# EAGLE design schematic (EAGLE 9.6.2)
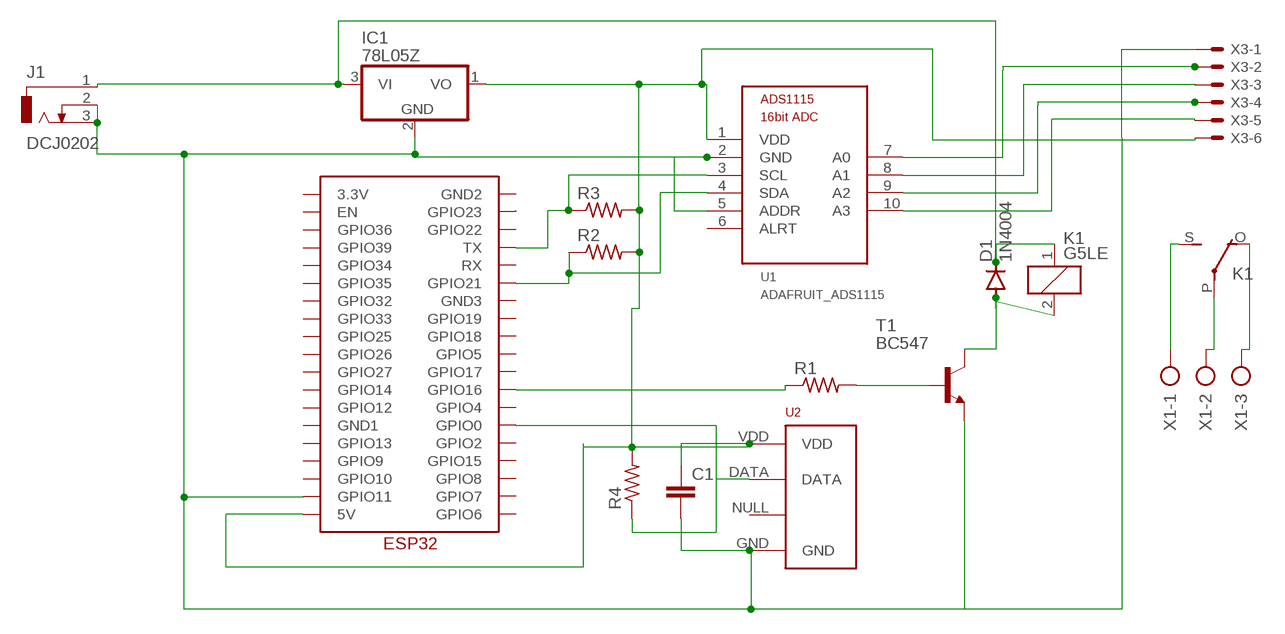
[diagram p0: schematic, sheet 1]

## Parts
C1  C-EU025-025X050  [C025-025X050]
D1  1N4004  [DO41-10]
IC1  78L05Z  [TO92]
J1  DCJ0202  [DCJ0202]
K1  G5LE  [G5LE]
R1  R-US_0309/12  [0309/12]
R2  R-US_0309/12  [0309/12]
R3  R-US_0309/12  [0309/12]
R4  R-US_0309/12  [0309/12]
T1  BC547  [TO92]
U1  ADAFRUIT_ADS1115  [ADAFRUIT_ADS1115_16BIT_I2C_ADC]
U2  RHT03_DHT-22_AM2302RA  [RHT03_DHT-22/RA]
U$1  ESP32_GRBL  [ESP32_GRBL]
X1  AK300/3  [AK300/3]
X3  KK-156-6  [KK-156-6]

## Nets
N$1: D1.A K1.2 T1.3(C)
N$2: U1.10(A3) X3.5
N$3: R1.1 U$1.GPIO16
N$4: R1.2 T1.2(B)
N$5: D1.C IC1.3(VI) J1.1 K1.1
N$6: R3.1 U1.3(SCL) U$1.TX
N$7: R2.1 U1.4(SDA) U$1.GPIO21
N$9: R4.1 U2.DATA U$1.GPIO0
N$10: C1.2 IC1.2(GND) J1.2 J1.3 T1.1(E) U1.2(GND) U1.5(ADDR) U2.GND U$1.GPIO11 X3.1
N$11: K1.S(2:S) X1.1
N$12: K1.P(2:P) X1.2
N$13: K1.O(2:O) X1.3
N$14: U$1.GPIO23
N$16: U1.8(A1) X3.3
N$19: C1.1 IC1.1(VO) R2.2 R3.2 R4.2 U1.1(VDD) U2.VDD U$1.5V X3.6
N$20: U1.9(A2) X3.4
N$21: U1.7(A0) X3.2
Unconnected: U1.6(ALRT) U2.NULL U$1.3.3V U$1.EN U$1.GND1 U$1.GND2 U$1.GND3 U$1.GPIO2 U$1.GPIO4 U$1.GPIO5 U$1.GPIO6 U$1.GPIO7 U$1.GPIO8 U$1.GPIO9 U$1.GPIO10 U$1.GPIO12 U$1.GPIO13 U$1.GPIO14 U$1.GPIO15 U$1.GPIO17 U$1.GPIO18 U$1.GPIO19 U$1.GPIO22 U$1.GPIO25 U$1.GPIO26 U$1.GPIO27 U$1.GPIO32 U$1.GPIO33 U$1.GPIO34 U$1.GPIO35 U$1.GPIO36 U$1.GPIO39 U$1.RX

## Library data of the parts
C1 = rcl:C-EU: CAPACITOR, European symbol; SPICEPREFIX: C
D1 = diode:1N4004: DIODE general purpose rectifier, 1 A
IC1 = linear:78*: Positive VOLTAGE REGULATOR Source: http://cache.national.com/ds/LM/LM78L05.pdf http://www.fairchildsemi.com/ds/LM/LM7805.pdf
J1 = con-jack:DCJ0202: DC POWER JACK Source: DCJ0202.pdf; OC_FARNELL: unknown; OC_NEWARK: unknown
K1 = relay:G5LE: RELAY 1 x switch, 10 A/120 V AC, 8 A/30 V DC, Omron; OC_FARNELL: unknown; OC_NEWARK: unknown
R1-R4 = adafruit:R-US_: RESISTOR, American symbol
T1 = transistor:BC547: NPN TRANSISTOR
U1 = AD convertor:ADAFRUIT_ADS1115
U2 = RHT03_DHT-22_AM2302:RHT03_DHT-22_AM2302: RHT03 / DHT-22 / AM2302 Packages and symbol for the RHT03 / DHT-22 relative humidity and temperature sensor. Note: The AM2302 is a wired version of the DHT-22 which typically requires less clearance and is thus provided as a separate package.; PROD_ID: SEN-10167
U$1 = ESP32:ESP32_GRBL
X1 = con-ptr500:AK300/3: CONNECTOR; OC_FARNELL: unknown; OC_NEWARK: unknown
X3 = con-molex:KK-156-6: KK 156 HEADER Source: http://www.molex.com/pdm_docs/sd/026604100_sd.pdf; MF: MOLEX; OC_FARNELL: unknown; OC_NEWARK: unknown

## Net classes
0 default: width 0.914 mm, drill 0.127 mm

## Board
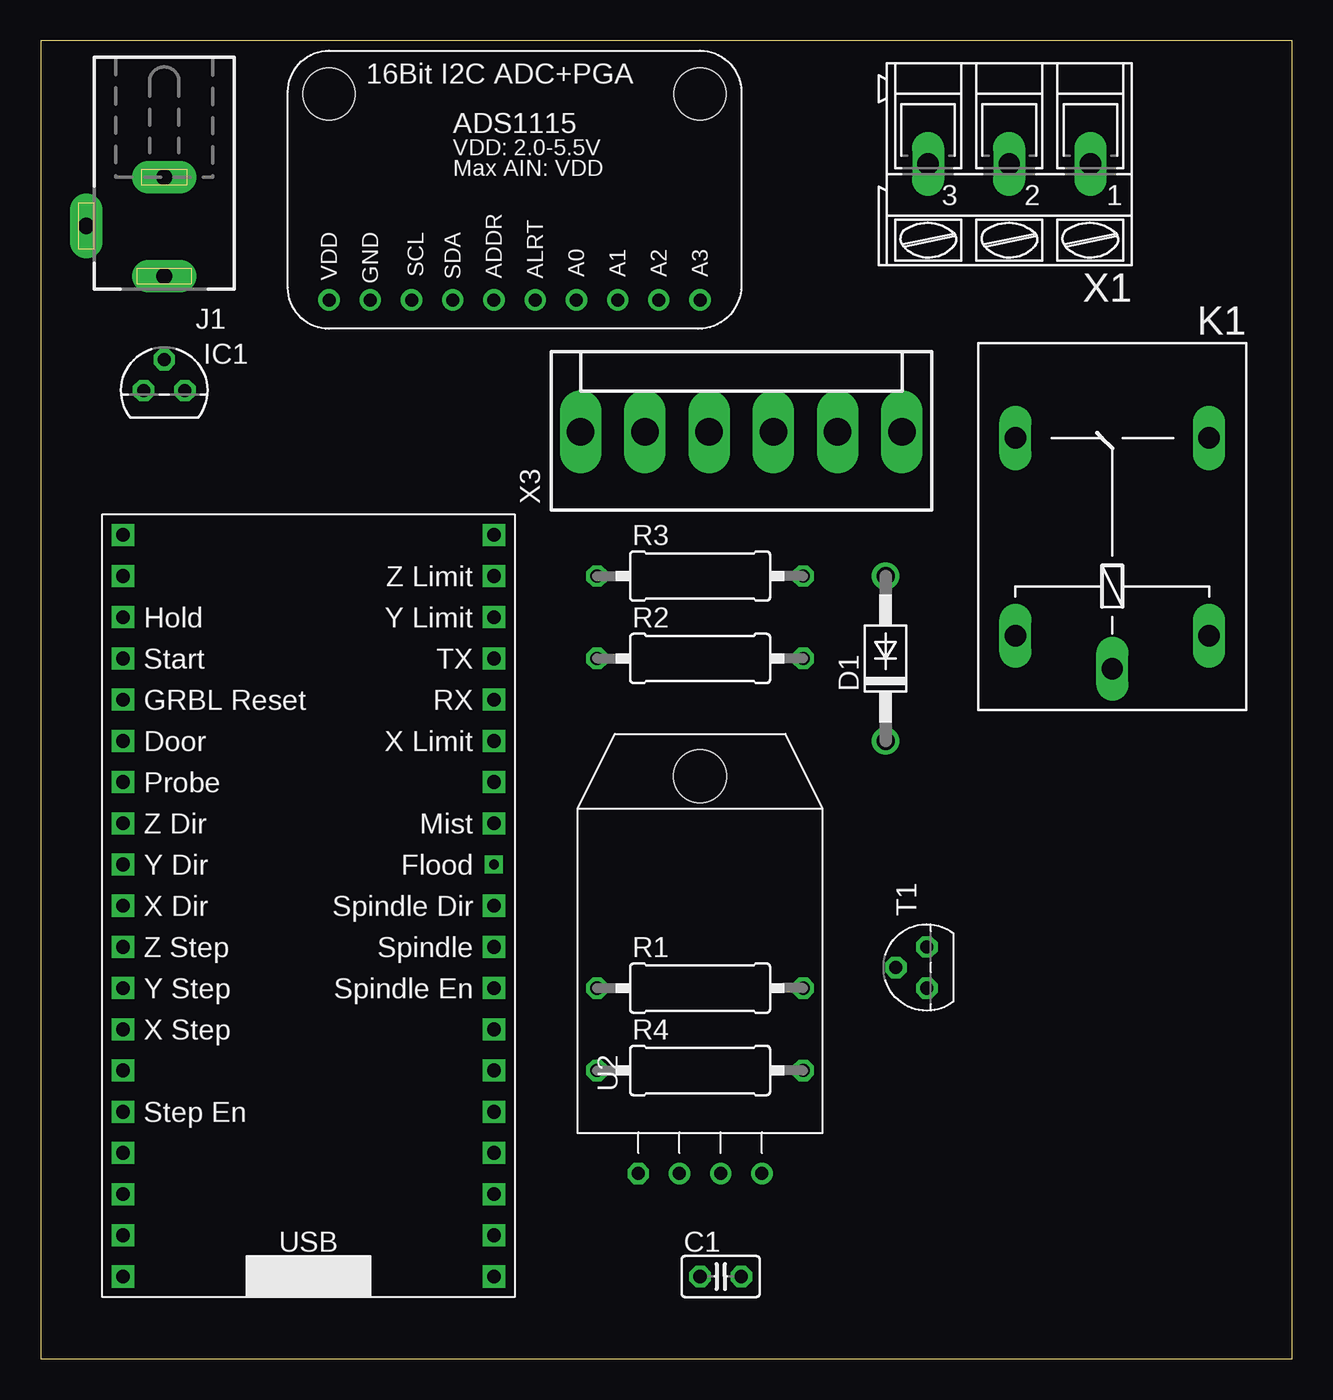
[diagram p1: board, top side]
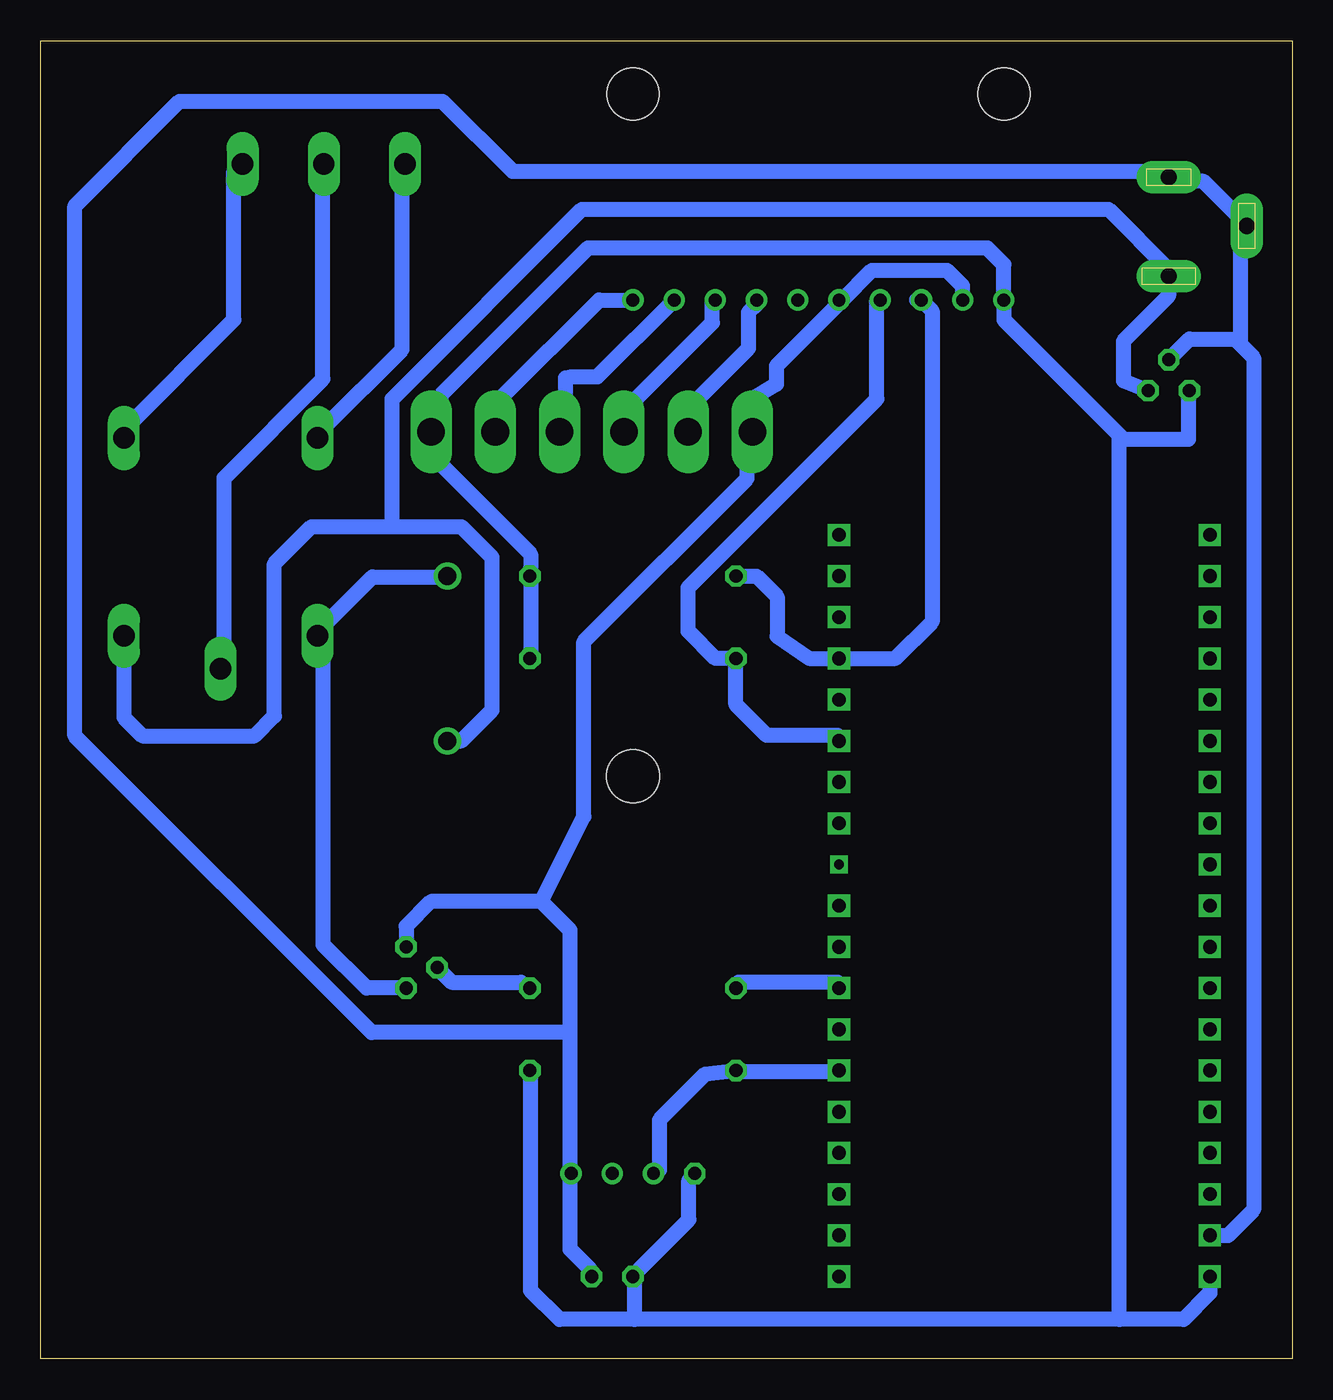
[diagram p2: board, bottom side, seen from below]

Size 77.14 x 81.27 mm. Coordinates in mm from the lower left corner, seen from the top.
Outline: 0,0 77.14,0 77.14,81.27 0,81.27 0,0
Copper layers (1*16): Top 0.035mm / dielectric 1.5mm / Bottom 0.035mm
Design rules "default": minimum track width 6mil, minimum drill 0.35mm, track to track 6mil, track to pad 6mil, pad to pad 6mil, via to via 6mil, smd to smd 6mil, copper to edge 40mil, drill to drill 6mil, minimum pad ring 10mil, minimum via ring 8mil, stop-mask expansion 4mil, vias tented up to drill 0mil, thermal gap 10mil

### Footprints (pad centres in the part's own frame; a part is rotated, then mirrored left to right if it is on the bottom)
C025-025X050 = drill 0.813 octagon: 1 -1.27,0; 2 1.27,0
DO41-10 = drill 1.118: A 5.08,0; C -5.08,0
TO92 = drill 0.813 octagon: 1 -1.27,0; 2 0,1.905; 3 1.27,0
DCJ0202 = drill 1 pad 2 long: 1 0,3.1; 2 4.8,0; 3 0,-3
G5LE = drill 1.321 long: 1 -7.493,-5.969; 2 -7.493,5.969; O 4.699,5.969; P -9.525,0; S 4.699,-5.969
0309/12 = drill 0.813 octagon: 1 -6.35,0; 2 6.35,0
TO92' = drill 0.813 octagon: 1 1.27,0; 2 0,1.905; 3 -1.27,0
ADAFRUIT_ADS1115_16BIT_I2C_ADC = drill 0.8: 1 2.54,1.778; 2 5.08,1.778; 3 7.62,1.778; 4 10.16,1.778; 5 12.7,1.778; 6 15.24,1.778; 7 17.78,1.778; 8 20.32,1.778; 9 22.86,1.778; 10 25.4,1.778 | hole 3.2: 2.54,14.478; 25.4,14.478
RHT03_DHT-22/RA = drill 0.8: DATA -1.27,0; GND 3.81,0; NULL 1.27,0 | drill 0.8 octagon: VDD -3.81,0 | hole 3.25: 0,24.5
ESP32_GRBL = drill 0.85 square: 3.3V 1.27,46.99; 5V 1.27,1.27; EN 1.27,44.45; GND1 1.27,13.97; GND2 24.13,46.99; GND3 24.13,31.75; GPIO0 24.13,13.97; GPIO2 24.13,11.43; GPIO4 24.13,16.51; GPIO5 24.13,24.13; GPIO6 24.13,1.27; GPIO7 24.13,3.81; GPIO8 24.13,6.35; GPIO9 1.27,8.89; GPIO10 1.27,6.35; GPIO11 1.27,3.81; GPIO12 1.27,16.51; GPIO13 1.27,11.43; GPIO14 1.27,19.05; GPIO15 24.13,8.89; GPIO16 24.13,19.05; GPIO17 24.13,21.59; GPIO19 24.13,29.21; GPIO21 24.13,34.29; GPIO22 24.13,41.91; GPIO23 24.13,44.45; GPIO25 1.27,26.67; GPIO26 1.27,24.13; GPIO27 1.27,21.59; GPIO32 1.27,31.75; GPIO33 1.27,29.21; GPIO34 1.27,36.83; GPIO35 1.27,34.29; GPIO36 1.27,41.91; GPIO39 1.27,39.37; RX 24.13,36.83; TX 24.13,39.37 | drill 0.6 square: GPIO18 24.13,26.67
AK300/3 = drill 1.321 long: 1 -5.004,0; 2 0,0; 3 5.004,0
KK-156-6 = drill 1.7 pad 2.184 long: 1 -9.9,0; 2 -5.94,0; 3 -1.98,0; 4 1.98,0; 5 5.94,0; 6 9.9,0

### Placement (x,y rotation side)
C1  41.91,5.08 0 top
D1  52.07,43.18 90 top
IC1  7.62,59.69 0 top
J1  7.62,69.85 180 top
K1  66.04,52.07 90 top
R1  40.64,22.86 0 top
R2  40.64,43.18 0 top
R3  40.64,48.26 0 top
R4  40.64,17.78 0 top
T1  BC547  [TO92']  54.61,24.13 90 top
U1  15.24,63.5 0 top
U2  40.64,11.43 0 top
U$1  3.81,3.81 0 top
X1  59.69,73.66 180 top
X3  43.18,57.15 0 top

### Tracks (layer width: path | path; a pad name or v marks a point on that pad's centre or on a via)
N$1
  Bottom 0.914: T1.3 57.05,22.86 59.74,25.55 59.74,44.55 K1.2 59.74,45.16 56.69,48.21 52.43,48.21 D1.A
N$2
  Bottom 0.914: U1.10 42.72,65.28 48.82,59.18 49.07,58.88 49.07,57.28 X3.5
N$3
  Bottom 0.914: R1.1 34.14,23.22 28.04,23.22 U$1.GPIO16
N$4
  Bottom 0.914: R1.2 47.55,23.22 51.82,23.22 52.43,23.82 T1.2
N$5
  Bottom 0.914: IC1.3 10.41,60.3 10.41,62.74 7.62,65.53 J1.1 7.62,67.16 11.33,70.87 43.79,70.87 55.47,59.18 55.47,51.31 | D1.C 51.21,38.1 49.33,39.98 49.33,49.43 51.21,51.31 55.47,51.31 | 55.47,51.31 60.45,51.31 62.74,49.02 62.74,39.62 63.96,38.41 70.87,38.41 72.01,39.55 K1.1
N$6
  Bottom 0.914: 23.16,65.28 U1.3 22.2,64.62 22.2,45.44 24.46,43.18 U$1.TX 29.77,43.18 31.75,44.55 31.75,46.99 33.02,48.26 R3.1
N$7
  Bottom 0.914: U1.4 25.6,65.28 25.6,59.18 37.24,47.55 37.24,44.86 35.56,43.18 R2.1 34.29,40.34 32.41,38.46 28.04,38.46 U$1.GPIO21
N$9
  Bottom 0.914: U2.DATA 39.01,11.63 39.01,14.73 36.18,17.57 R4.1 34.14,17.73 28.04,17.73 U$1.GPIO0
N$10
  Bottom 0.914: 3.05,69.55 J1.2 | U$1.GPIO11 3.96,7.62 2.39,9.2 2.39,61.72 3.53,62.87 | J1.2 3.05,70.16 5.49,72.59 7.32,72.59 J1.3 7.92,73.2 48.06,73.2 52.38,77.52 68.58,77.52 75.03,71.07 75.03,38.41 56.74,20.12 44.5,20.12 | C1.2 43.28,5.54 44.5,6.76 44.5,11.02 U2.GND 44.5,11.63 44.5,20.12 | 46.28,28.19 53.09,28.19 54.61,26.67 T1.1 | 46.28,28.19 44.5,26.42 44.5,20.12 | U1.2 20.32,66.14 21.29,67.11 25.91,67.11 27.74,65.28 | 28.04,65.28 U1.5 27.74,65.28 | 27.74,65.28 31.8,61.21 31.8,60.09 33.28,59.19 X3.1 33.6,56.74 33.6,54.28 43.66,44.22 43.66,33.43 46.28,28.19 | IC1.2 6.35,62.87 3.53,62.87 | 3.53,62.87 3.2,62.87 3.2,69.47 J1.2
N$11
  Bottom 0.914: X1.1 65.23,73.2 65.23,64.06 71.93,57.35 K1.S
N$12
  Bottom 0.914: X1.2 59.74,73.2 59.74,60.4 65.84,54.3 65.84,42.72 K1.P
N$13
  Bottom 0.914: X1.3 54.86,73.2 54.86,62.23 59.74,57.35 K1.O
N$16
  Bottom 0.914: U1.8 35.74,65.28 35.74,63.88 41.07,58.55 41.07,57.28 X3.3
N$19
  Bottom 0.914: U2.VDD 37.19,11.02 37.19,8.59 40.23,5.54 C1.1 40.54,5 40.54,2.44 | 10.57,56.85 17.78,64.06 U1.1 17.78,67.46 18.8,68.48 43.41,68.48 52.48,59.41 52.48,57.61 52.81,57.28 X3.6 53.08,55.75 46.94,49.61 46.94,48.74 R3.2 46.94,48.21 46.94,43.41 R2.2 | 10.57,56.85 10.41,56.69 6.4,56.69 6.4,59.41 IC1.1 | 10.67,2.44 6.71,2.44 5.08,4.06 U$1.5V | 10.67,2.44 40.54,2.44 | 40.54,2.44 45.16,2.44 46.94,4.22 46.94,17.73 R4.2 | 10.67,2.44 10.67,56.74 10.57,56.85
N$20
  Bottom 0.914: U1.9 42.82,60.55 44.45,60.55 44.81,60.48 44.81,57.28 X3.4
N$21
  Bottom 0.914: U1.7 33.02,65.02 33.53,64.52 33.53,62.28 36.72,59.09 X3.2